# Altium schematic sheet CT_switching.SchDoc: Triumvi - Sensing - CT Switching
size Letter; Author: Ye-Sheng Kuo; Revision: 9; SheetNumber: 5; SheetTotal: 6
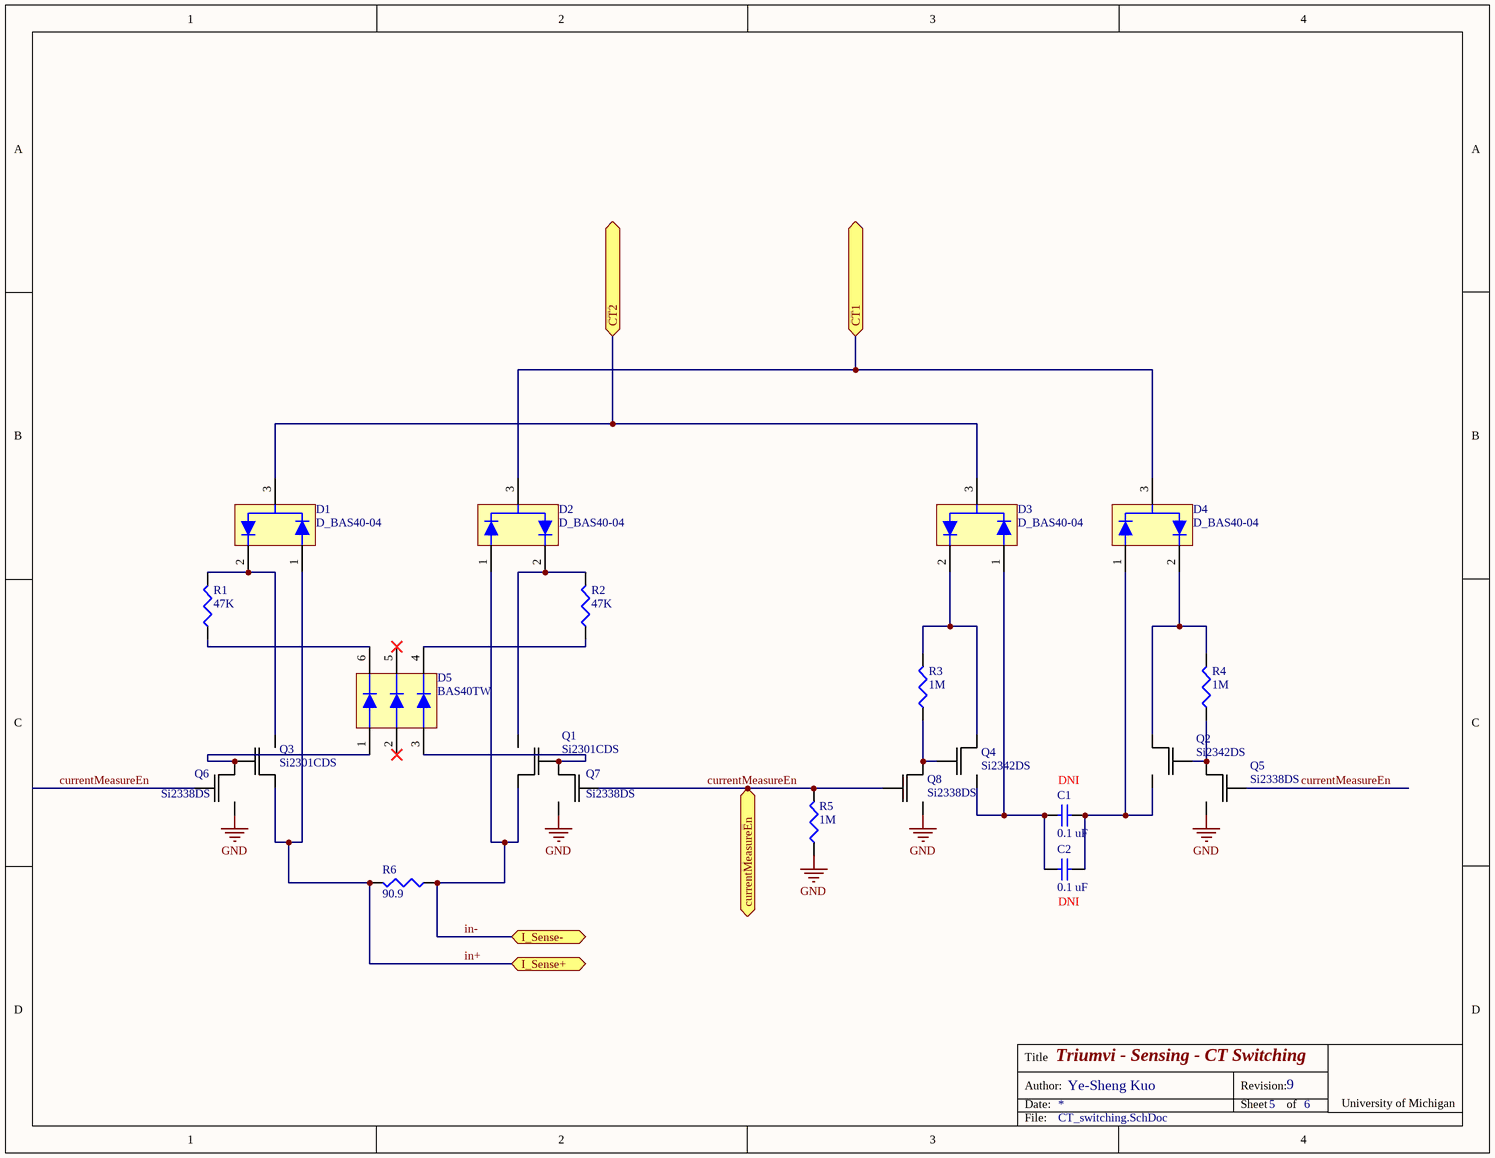
[diagram p0: CT_switching.SchDoc]

## Parts
C1  value 0.1 uF  [0603]  (hidden comment: Ceramic capacitor)
C2  value 0.1 uF  [0603]  (hidden comment: Ceramic capacitor)
D1  D_BAS40-04  [SOT23-3]
D2  D_BAS40-04  [SOT23-3]
D3  D_BAS40-04  [SOT23-3]
D4  D_BAS40-04  [SOT23-3]
D5  BAS40TW  [SOT-363]
Q1  Si2301CDS  [SOT23-3]
Q2  Si2342DS  [SOT23-3]
Q3  Si2301CDS  [SOT23-3]
Q4  Si2342DS  [SOT23-3]
Q5  Si2338DS  [SOT23-3]
Q6  Si2338DS  [SOT23-3]
Q7  Si2338DS  [SOT23-3]
Q8  Si2338DS  [SOT23-3]
R1  value 47K  [0402]  (hidden comment: Chip resistor)
R2  value 47K  [0402]  (hidden comment: Chip resistor)
R3  value 1M  [0402]  (hidden comment: Chip resistor)
R4  value 1M  [0402]  (hidden comment: Chip resistor)
R5  value 1M  [0402]  (hidden comment: Chip resistor)
R6  value 90.9  [0603]  (hidden comment: Chip resistor)

## Ports
CT1, CT2, currentMeasureEn, I_Sense+, I_Sense-

## Nets
GND: Q5.2(S) Q6.2(S) Q7.2(S) Q8.2(S) R5.2
CT1: D2.3 D4.3 ; port CT1
CT2: D1.3 D3.3 ; port CT2
currentMeasureEn: Q5.1(G) Q6.1(G) Q7.1(G) Q8.1(G) R5.1 ; port currentMeasureEn
in+: D1.1 Q3.3(D) R6.1 ; port I_Sense+
in-: D2.1 Q1.3(D) R6.2 ; port I_Sense-
NetC1_1: C1.1 C2.1 D3.1 Q4.2(S)
NetC1_2: C1.2 C2.2 D4.1 Q2.2(S)
NetD1_2: D1.2 Q3.2(S) R1.1
NetD2_2: D2.2 Q1.2(S) R2.1
NetD3_2: D3.2 Q4.3(D) R3.1
NetD4_2: D4.2 Q2.3(D) R4.1
NetD5_1: D5.1 Q3.1(G) Q6.3(D)
NetD5_3: D5.3 Q1.1(G) Q7.3(D)
NetD5_4: D5.4 R2.2
NetD5_6: D5.6 R1.2
NetQ2_1: Q2.1(G) Q5.3(D) R4.2
NetQ4_1: Q4.1(G) Q8.3(D) R3.2

Not connected (* = marked no-connect by the designer): D5 2* 5*

## Notes on the sheet
- (near C1) DNI
- (near C2) DNI
- Title
- Date:
- Author:
- Revision:
- Sheet
- of
- University of Michigan
- File:

## Library data of the parts
C1 C2 = C_0.1u_25V_0603_ceramic: Ceramic capacitor, 0.1 uF, 0603 package; Manufacture: TDK; voltage rated: 25V; tolerance: 10%; package: 0603; Supplier 1: Digi-Key; Supplier Part Number 1: 445-1316-1-ND
D1-D4 = D_BAS40-04: SURFACE MOUNT SCHOTTKY BARRIER DIODE; Supplier 1: Digi-Key; Supplier Part Number 1: BAS40-04FDICT-ND
D5 = D_BAS40TW: SURFACE MOUNT SCHOTTKY BARRIER DIODE ARRAYS; Supplier 1: Digi-Key; Supplier Part Number 1: BAS40TW-FDICT-ND
Q1 Q3 = Si2301CDS: P-Channel 20 V (D-S) MOSFET; Supplier 1: Digi-Key; Supplier Part Number 1: SI2301CDS-T1-E3CT-ND
Q2 Q4 = Si2342DS: N-Channel 8 V (D-S) MOSFET; Supplier 1: Digi-Key; Supplier Part Number 1: SI2342DS-T1-GE3CT-ND
Q5-Q8 = Si2338DS: N-Channel 30 V (D-S) MOSFET; Supplier 1: Digi-Key; Supplier Part Number 1: SI2338DS-T1-GE3CT-ND
R1 R2 = R_47K_0402: Chip resistor, 47K, 0402 package; tolerance: 1%; power: 1/16 W; package: 0402; Supplier 1: Digi-Key; Supplier Part Number 1: 541-47.0KLCT-ND
R3-R5 = R_1M_0402: Chip resistor, 1M, 0402 package; tolerance: 1%; power: 1/16 W; Supplier 1: Digi-Key; Supplier Part Number 1: 541-1.00MLCT-ND; package: 0402
R6 = R_90.9_0603: Chip resistor, 90.9, 0603 package; tolerance: 0.1%; power: 1/10 W; package: 0603; Supplier 1: Digi-Key; Supplier Part Number 1: P90.9DBCT-ND